# EAGLE design AYDINLATMA_MODUL (EAGLE 9.6.2)
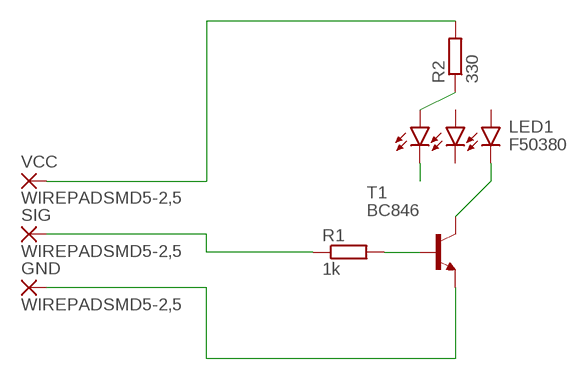
[diagram p0: schematic, sheet 1]

## Parts
GND  WIREPADSMD5-2,5  [5-2,5]
LED1  F50380  [F50380]
R1  1k  R-EU_R0805  [R0805]
R2  330  R-EU_R0805  [R0805]
SIG  WIREPADSMD5-2,5  [5-2,5]
T1  BC846  [SOT23]
VCC  WIREPADSMD5-2,5  [5-2,5]

## Nets
N$1: R1.2 T1.1(B)
N$2: LED1.R- T1.3(C)
N$3: GND.1(P) T1.2(E)
N$4: LED1.B+ R2.1
N$5: R1.1 SIG.1(P)
N$6: R2.2 VCC.1(P)
N$7: LED1.B-
Unconnected: LED1.G+ LED1.G- LED1.R+ LED1.TH

## Library data of the parts
GND SIG VCC = wirepad:WIREPAD: Wire PAD connect wire on PCB
LED1 = led:F50380: Z-POWER LED Source: www.zpowerled.com .. F50380.pdf
R1 R2 = rcl:R-EU_: RESISTOR, European symbol; SPICEPREFIX: R
T1 = transistor:BC846: NPN TRANSISTOR

## Board
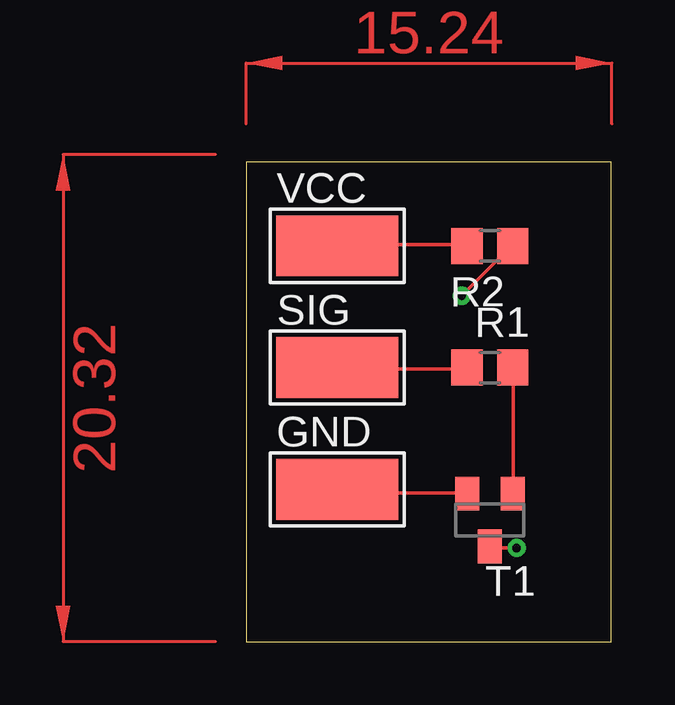
[diagram p1: board, top side]
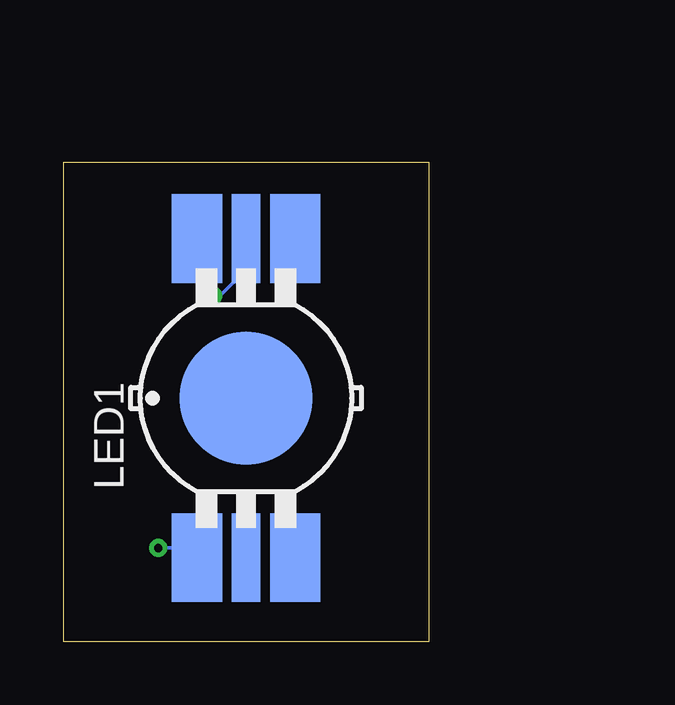
[diagram p2: board, bottom side, seen from below]

Size 15.22 x 19.99 mm. Coordinates in mm from the lower left corner, seen from the top.
Outline: 0,0 15.22,0 15.22,19.99 0,19.99 0,0
Copper layers (1*16): Top 0.035mm / dielectric 1.5mm / Bottom 0.035mm
Design rules "default": minimum track width 6mil, minimum drill 0.35mm, track to track 6mil, track to pad 6mil, pad to pad 6mil, via to via 6mil, smd to smd 6mil, copper to edge 40mil, drill to drill 6mil, minimum pad ring 10mil, minimum via ring 8mil, stop-mask expansion 4mil, vias tented up to drill 0mil, thermal gap 10mil

### Footprints (pad centres in the part's own frame; a part is rotated, then mirrored left to right if it is on the bottom)
5-2,5 = smd 2.54 x 5.08: 1 0,0
F50380 = smd 3.7 x 1.2: B+ 6.65,0; G- -6.65,0 | smd 3.7 x 2.1: B- 6.65,2.05; G+ -6.65,-2.05; R+ 6.65,-2.05; R- -6.65,2.05 | smd 5.55 x 5.55: TH 0,0
R0805 = smd 1.3 x 1.5: 1 -0.95,0; 2 0.95,0
SOT23 = smd 1 x 1.4: 1 -0.95,-1.1; 2 0.95,-1.1; 3 0,1.1

### Placement (x,y rotation side)
GND  3.81,6.35 270 top
LED1  7.62,10.16 90 bottom
R1  10.16,11.43 0 top
R2  10.16,16.51 180 top
SIG  3.81,11.43 270 top
T1  10.16,5.08 180 top
VCC  3.81,16.51 270 top

### Tracks (layer width: path | path; a pad name or v marks a point on that pad's centre or on a via)
N$1
  Top 0.152: T1.1 11.12,6.2 11.12,11.38 R1.2
N$2  (via drill 0.35)
  Top 0.152: v11.28,3.91 10.21,3.91 T1.3
  Bottom 0.152: v11.28,3.91 10.06,3.91 9.75,3.61 LED1.R-
N$3
  Top 0.152: GND.1 3.96,6.2 9.14,6.2 T1.2
N$4  (via drill 0.35)
  Top 0.152: v8.99,14.43 10.97,16.41 R2.1
  Bottom 0.152: v8.99,14.43 8.69,14.43 7.62,15.49 LED1.B+
N$5
  Top 0.152: R1.1 9.14,11.38 3.81,11.38 SIG.1
N$6
  Top 0.152: R2.2 9.14,16.56 3.81,16.56 VCC.1
(copper drawn outside any net)
  shapes: Top area x2